# Altium schematic sheet [05] Amplifier.SchDoc: DAC
size A4; Organization: Blinkinlabs, LLC; DocumentNumber: 5; SheetNumber: 5; SheetTotal: 7
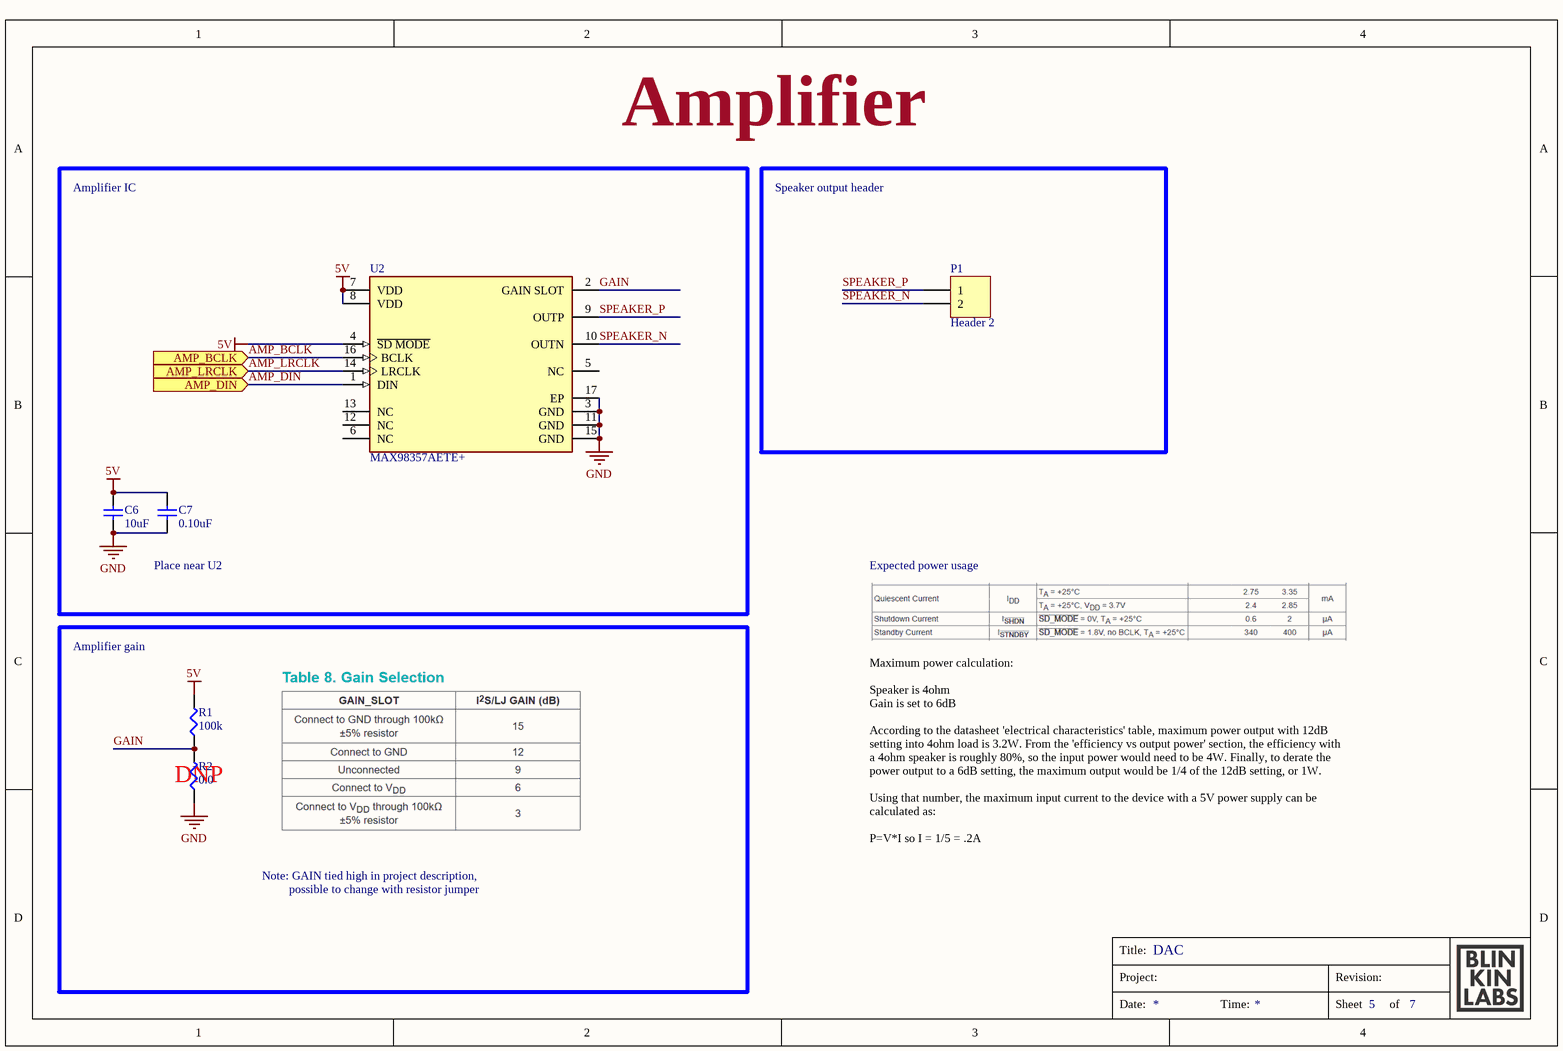
[diagram p0: [05] Amplifier.SchDoc]

## Parts
C6  10uF  [CAPC1608X09L]
C7  0.10uF  [CAPC1005X06L]
P1  Header 2  [HDR1X2]
R1  100k  [ERJ2G(0402)_L]
R2  0.0  [ERJ2G(0402)_L]
U2  MAX98357AETE+  [FP-T1633-4-MFG]

## Blocks framed on the sheet
Speaker output header: P1
DNP: R1 R2

## Ports
AMP_BCLK (in), AMP_DIN (in), AMP_LRCLK (in)

## Nets
5V: C6.1 C7.2 R1.2 U2.4(~{SD_MODE}) U2.7(VDD) U2.8(VDD)
GND: C6.2 C7.1 R2.1 U2.3(GND) U2.11(GND) U2.15(GND) U2.17(EP)
AMP_BCLK: U2.16(BCLK) ; port AMP_BCLK
AMP_DIN: U2.1(DIN) ; port AMP_DIN
AMP_LRCLK: U2.14(LRCLK) ; port AMP_LRCLK
GAIN: R1.1 R2.2 U2.2(GAIN_SLOT)
SPEAKER_N: P1.2 U2.10(OUTN)
SPEAKER_P: P1.1 U2.9(OUTP)

Not connected (* = marked no-connect by the designer): U2 5(NC) 6(NC) 12(NC) 13(NC)

## Notes on the sheet
- Amplifier
- Amplifier IC
- Place near U2
- Expected power usage
- Amplifier gain
- Maximum power calculation:
  Speaker is 4ohm
  Gain is set to 6dB
  According to the datasheet 'electrical characteristics' table, maximum power output with 12dB setting into 4ohm load is 3.2W. From the 'efficiency vs output power' section, the efficiency with a 4ohm speaker is roughly 80%, so the input power would need to be 4W. Finally, to derate the power output to a 6dB setting, the maximum output would be 1/4 of the 12dB setting, or 1W.
  Using that number, the maximum input current to the device with a 5V power supply can be calculated as:
  P=V*I so I = 1/5 = .2A
- Note: GAIN tied high in project description,
- possible to change with resistor jumper
- Title:
- Project:
- Revision:
- Date:
- Time:
- Sheet
- of

## Library data of the parts
C6 = GRM188R61A106KE69D: CAP CER 10UF 10V X5R 0603; Manufacturer: Murata Electronics North America; Tolerance: ±10%; PartNumber: GRM188R61A106KE69D; Datasheets: http://www.murata.com/~/media/webrenewal/support/library/catalog/products/capacitor/mlcc/c02e.pdf; Image: //media.digikey.com/Renders/Murata%20Renders/ZRB-SERIES-0402.jpg; Digi-Key Part Number: 490-10474-1-ND; Series: GRM; Value: 10uF; Voltage: 10V; Temperature Coefficient: X5R; Operating Temperature: -55°C ~ 85°C; Features: Derating Recommended; Applications: General Purpose; Package / Case: 0603 (1608 Metric); Case/Package: 0603
C7 = GRM152R61A104ME19D: CAP CER 0.1UF 10V X5R 0402; Manufacturer: Murata Electronics North America; Tolerance: ±20%; Datasheets: http://www.murata.com/~/media/webrenewal/support/library/catalog/products/capacitor/mlcc/c02e.pdf; Image: //media.digikey.com/Renders/Murata%20Renders/ZRB-SERIES-0402.jpg; Digi-Key Part Number: 490-10009-1-ND; Packaging: Cut Tape (CT); Series: GRM; Value: 0.10uF; Voltage: 10V; Temperature Coefficient: X5R; Operating Temperature: -55°C ~ 85°C; Features: Derating Recommended; Applications: General Purpose; Package / Case: 0402 (1005 Metric); Case/Package: 0402; PartNumber: GRM152R61A104ME19D
P1 = Header 2: Header, 2-Pin; LatestRevisionDate: 17-Jul-2002; LatestRevisionNote: Re-released for DXP Platform.; Publisher: Altium Limited
R1 = ERJ-2GEJ104X: RES SMD 100K OHM 5% 1/10W 0402; Manufacturer: Panasonic Electronic Components; Power (Watts): 0.1W, 1/10W; Temperature Coefficient: ±200ppm/°C; PartNumber: ERJ-2GEJ104X; Datasheets: http://industrial.panasonic.com/www-cgi/jvcr13pz.cgi?E+PZ+3+AOA0001+ERJ2GEJ104X+7+WW; Image: //media.digikey.com/Photos/Panasonic%20Photos/ERJ-PA2-Series.jpg; Digi-Key Part Number: P100KJCT-ND; Series: ERJ; Value: 100k; Tolerance: ±5%; Composition: Thick Film; Features: Automotive AEC-Q200; Operating Temperature: -55°C ~ 155°C; Package / Case: 0402 (1005 Metric); Case/Package: 0402; Size / Dimension: 0.039" L x 0.020" W (1.00mm x 0.50mm); Height - Seated (Max): 0.016" (0.40mm); Number of Terminations: 2
R2 = ERJ-2GE0R00X: RES SMD 0.0OHM JUMPER 1/10W 0402; Manufacturer: Panasonic Electronic Components; Power (Watts): 0.1W, 1/10W; PartNumber: ERJ-2GE0R00X; Datasheets: http://industrial.panasonic.com/www-cgi/jvcr13pz.cgi?E+PZ+3+AOA0001+ERJ2GE0R00X+7+WW; Image: //media.digikey.com/Photos/Panasonic%20Photos/ERJ-PA2-Series.jpg; Digi-Key Part Number: P0.0JCT-ND; Series: ERJ; Value: 0.0; Tolerance: Jumper; Composition: Thick Film; Features: Automotive AEC-Q200; Temperature Coefficient: -; Operating Temperature: -55°C ~ 155°C; Package / Case: 0402 (1005 Metric); Case/Package: 0402; Size / Dimension: 0.039" L x 0.020" W (1.00mm x 0.50mm); Height - Seated (Max): 0.016" (0.40mm); Number of Terminations: 2
U2 = CMP-05698-000004-1: IC AMP CLASS D MONO 3.2W 16TQFN; Supply Type: Single; Load Impedance: 4R; Power Supply Rejection Ratio (PSRR): 77dB; Gain: 15dB; Max Supply Voltage: 5.5V; Operating Supply Voltage: 5V; Max Power Dissipation: 1.666W; Max Output Current: 1.6A; Min Supply Voltage: 2.5V; Operating Supply Current: 2.75mA; Number of Channels: 1; Max Operating Temperature: 85°C; Number of Pins: 16; Mount: Surface Mount; Package Quantity: 490; Packaging: Rail/Tube; Min Operating Temperature: -40°C; Voltage Gain: 15dB; Max Output Power: 3.2W; Output Power: 3.2W; Contact Plating: Tin; Radiation Hardening: No